# Altium schematic sheet Main.SchDoc
size 81 x 35 mm
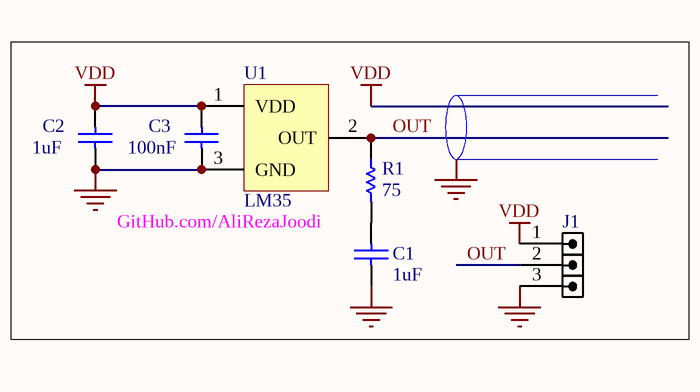
[diagram p0: Main.SchDoc]

## Parts
C1  1uF  [0805]
C2  1uF  [0805]
C3  100nF  [0805]
J1  2PIN  [HEADER_THD_STAND_MALE_1X3]  (value not drawn)
R1  75  [0805]
U1  LM35  [TO92_3Pin_Form6]

## Nets
GND: C1.1 C2.1 C3.1 J1.3 U1.3(GND)
VDD: C2.2 C3.2 J1.1 U1.1(VDD)
OUT: J1.2 R1.1 U1.2(OUT)
NetC1_2: C1.2 R1.2

## Notes on the sheet
- GitHub.com/AliRezaJoodi
- Labels drawn without touching a wire or pin: GND

## Library data of the parts
C1-C3 = Cap: Capacitor; Manufacturer: Generic Components; Class I: Passive; Published: 8-Jun-2000; Revision: July-2002: Re-released for DXP Platform.; Publisher: Altium Limited; Class II: Capacitor
J1 = Connector1x3_Male: Connector, Header, 2Pin
R1 = Res1: Resistor; Published: 8-Jun-2000; LatestRevisionDate: 17-Jul-2002; LatestRevisionNote: Re-released for DXP Platform.; PackageReference: AXIAL-0.3; Publisher: Altium Limited
U1 = Sensor_LM35: Temperature Sensors